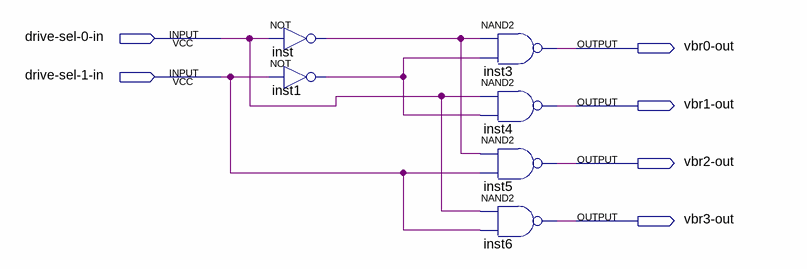
[diagram p0: schematic sheet]
// Quartus schematic drive_select_decoder.bdf as structural Verilog: 6 symbols, 6 pins
module drive_select_decoder (
  input  \drive-sel-0-in ,
  input  \drive-sel-1-in ,
  output \vbr0-out ,
  output \vbr1-out ,
  output \vbr2-out ,
  output \vbr3-out 
);

  wire inst1_out, inst_out;

  not inst (inst_out, \drive-sel-0-in );
  not inst1 (inst1_out, \drive-sel-1-in );
  nand inst3 (\vbr0-out , inst_out, inst1_out);
  nand inst4 (\vbr1-out , \drive-sel-0-in , inst1_out);
  nand inst5 (\vbr2-out , inst_out, \drive-sel-1-in );
  nand inst6 (\vbr3-out , \drive-sel-0-in , \drive-sel-1-in );
endmodule
